# EAGLE design fabisp (EAGLE 7.5.0)
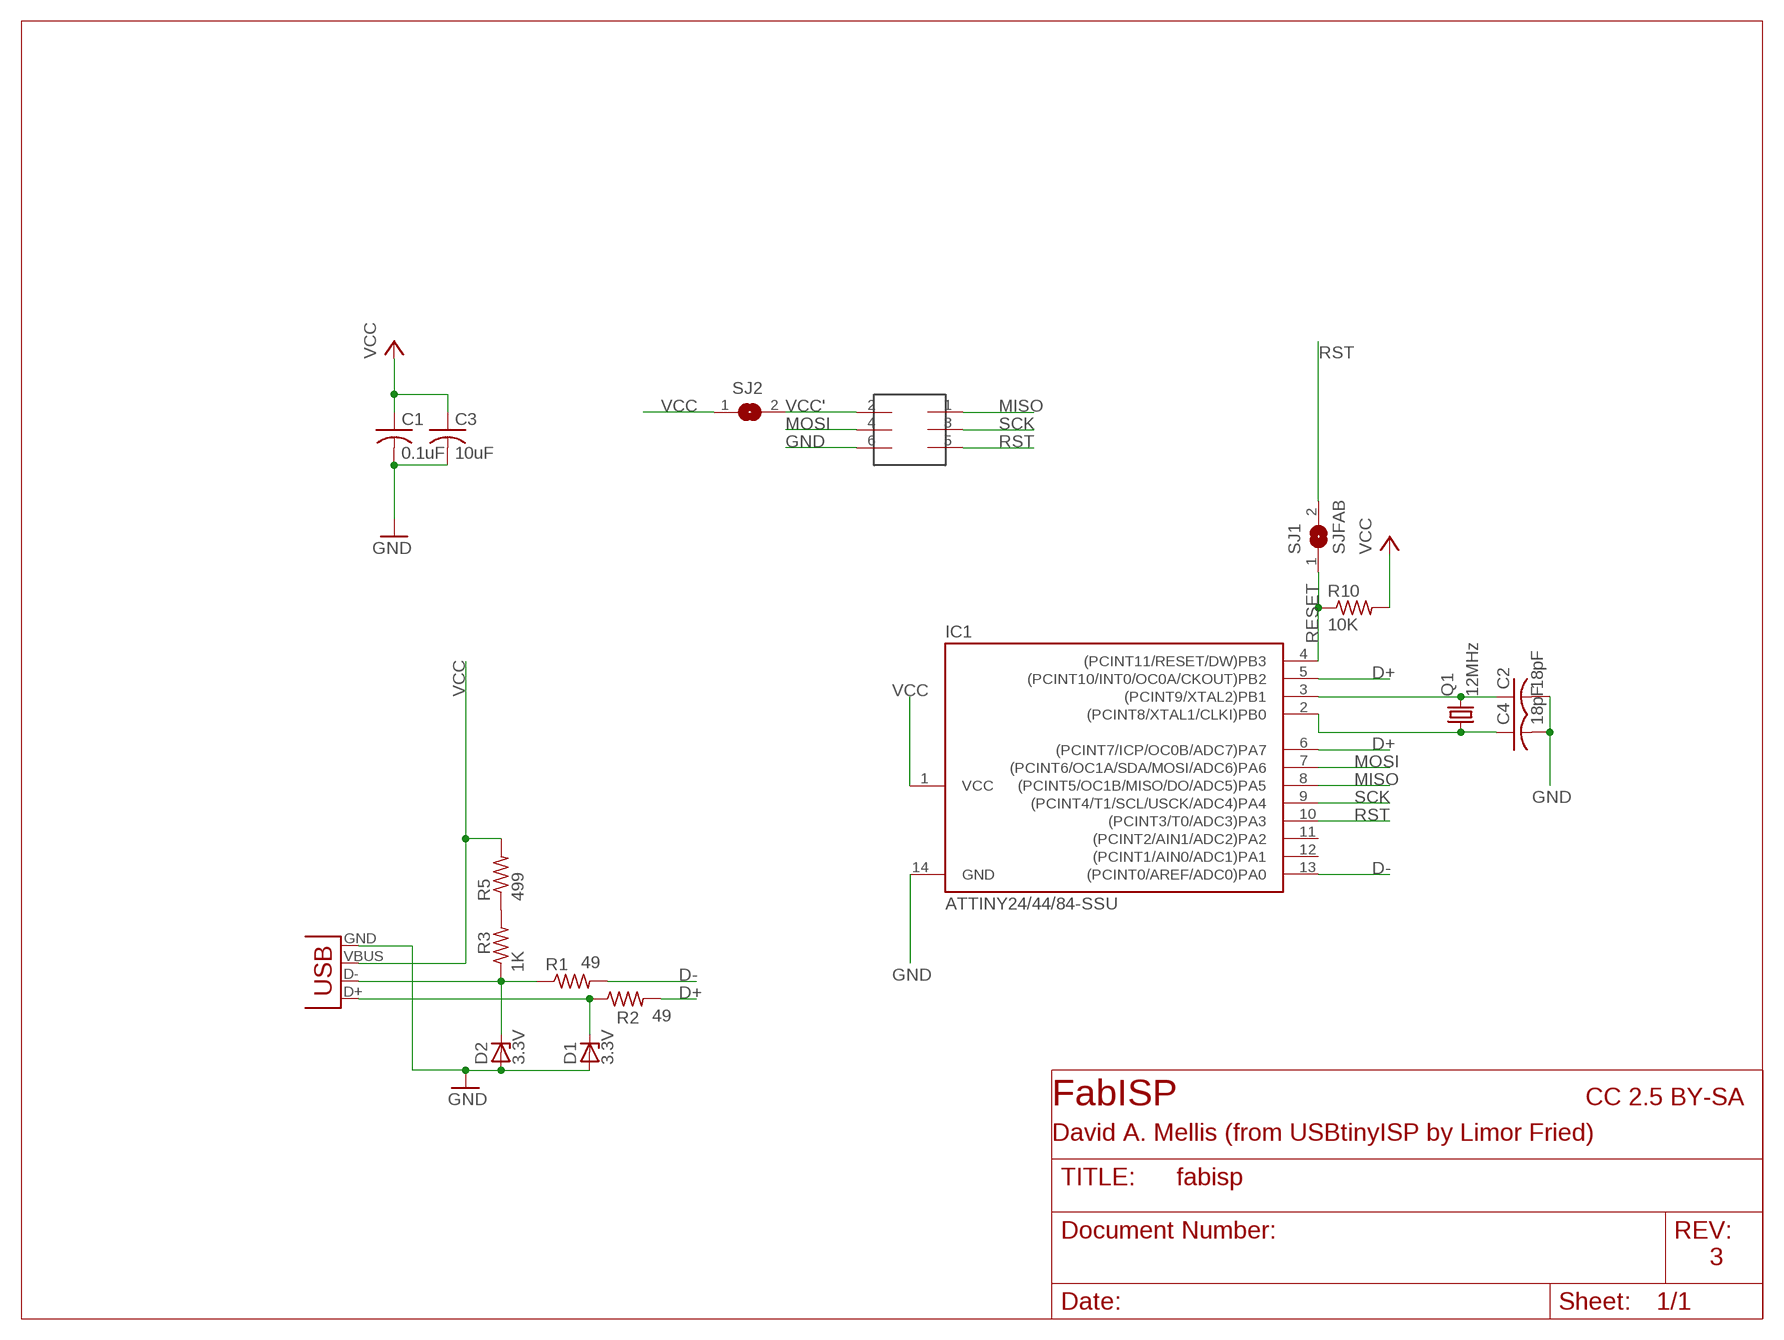
[diagram p0: schematic, sheet 1]

## Parts
C1  0.1uF  C-USC1206  [C1206]
C2  18pF  C-USC1206  [C1206]
C3  10uF  C-USC1206  [C1206]
C4  18pF  C-USC1206  [C1206]
D1  3.3V  ZENER_DIODESOD123  [SOD123]
D2  3.3V  ZENER_DIODESOD123  [SOD123]
IC1  ATTINY24/44/84-SSU  [SOIC14]
Q1  12MHz  CRYSTALHC49UP  [HC49UP]
R1  49  R-US_R1206  [R1206]
R2  49  R-US_R1206  [R1206]
R3  1K  R-US_R1206  [R1206]
R5  499  R-US_R1206  [R1206]
R10  10K  R-US_R1206  [R1206]
SJ1  SJFAB  [SJFAB]
SJ2  SJFAB  [SJFAB]
U$1  2X3HEADER  [2X3_SMD]
X1  USB_MINIB  [USB_MINIB]

## Nets
D+: IC1.5((PCINT10/INT0/OC0A/CKOUT)PB2) IC1.6((PCINT7/ICP/OC0B/ADC7)PA7) R2.2
D-: IC1.13((PCINT0/AREF/ADC0)PA0) R1.2
GND: C1.2 C2.2 C3.2 C4.2 D1.ANODE D2.ANODE IC1.14(GND) U$1.6 X1.GND
MISO: IC1.8((PCINT5/OC1B/MISO/DO/ADC5)PA5) U$1.1
MOSI: IC1.7((PCINT6/OC1A/SDA/MOSI/ADC6)PA6) U$1.4
N$1: D2.CATHODE R1.1 R3.1 X1.D-
N$2: D1.CATHODE R2.1 X1.D+
N$4: C4.1 IC1.2((PCINT8/XTAL1/CLKI)PB0) Q1.1
N$5: C2.1 IC1.3((PCINT9/XTAL2)PB1) Q1.2
N$6: R3.2 R5.1
RESET: IC1.4((PCINT11/RESET/DW)PB3) R10.1 SJ1.1
RST: IC1.10((PCINT3/T0/ADC3)PA3) SJ1.2 U$1.5
SCK: IC1.9((PCINT4/T1/SCL/USCK/ADC4)PA4) U$1.3
VCC: C1.1 C3.1 IC1.1(VCC) R5.2 R10.2 SJ2.1 X1.VBUS
VCC': SJ2.2 U$1.2
Unconnected: IC1.11((PCINT2/AIN1/ADC2)PA2) IC1.12((PCINT1/AIN0/ADC1)PA1)

## Notes on the sheet
- FabISP | CC 2.5 BY-SA
- David A. Mellis (from USBtinyISP by Limor Fried)
- 3

## Library data of the parts
C1 = rcl-ez:C-US: CAPACITOR, American symbol
C2-C4 = rcl:C-US: CAPACITOR, American symbol
D1 D2 = ng:ZENER_DIODE: zener diode
IC1 = attiny24_44_84:ATTINY24/44/84
Q1 = crystal:CRYSTAL: CRYSTAL
R1-R3 R10 = rcl-ez:R-US_: RESISTOR, American symbol
R5 = rcl:R-US_: RESISTOR, American symbol
SJ1 SJ2 = mellis:SJFAB
U$1 = mellis:2X3HEADER
X1 = mellis:USB_MINIB

## Board
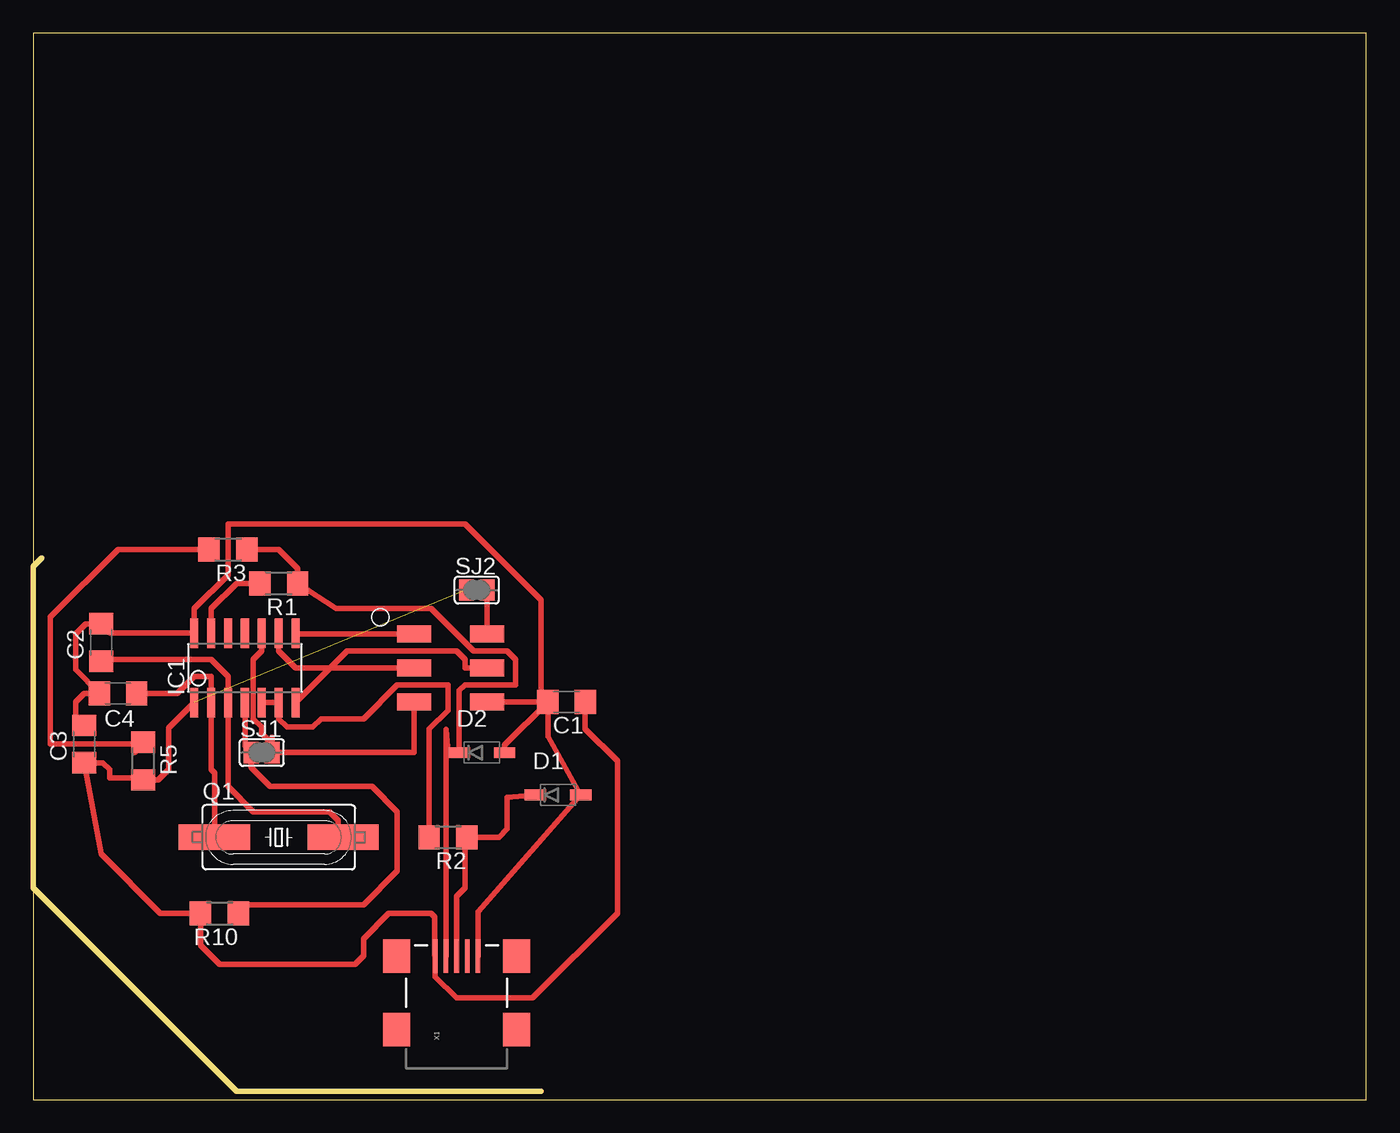
[diagram p1: board, top side]

Size 100 x 80 mm. Coordinates in mm from the lower left corner, seen from the top.
Outline: 0,0 100,0 100,80 0,80 0,0
Copper layers (1*16): Top 0.035mm / dielectric 1.5mm / Bottom 0.035mm
Design rules "default": minimum track width 10mil, minimum drill 24mil, track to track 8mil, track to pad 8mil, pad to pad 8mil, via to via 8mil, smd to smd 8mil, copper to edge 40mil, drill to drill 8mil, minimum pad ring 10mil, minimum via ring 8mil, stop-mask expansion 4mil, vias tented up to drill 0mil, thermal gap 10mil
Milling: 4 lines

### Footprints (pad centres in the part's own frame; a part is rotated, then mirrored left to right if it is on the bottom)
C1206 = smd 1.6 x 1.8: 1 -1.4,0; 2 1.4,0
SOD123 = smd 1.6 x 0.8: ANODE 1.7,0; CATHODE -1.7,0
SOIC14 = smd 0.61 x 2.21: 1 -3.81,-2.603; 2 -2.54,-2.603; 3 -1.27,-2.603; 4 0,-2.603; 5 1.27,-2.603; 6 2.54,-2.603; 7 3.81,-2.603; 8 3.81,2.603; 9 2.54,2.603; 10 1.27,2.603; 11 0,2.603; 12 -1.27,2.603; 13 -2.54,2.603; 14 -3.81,2.603
HC49UP = smd 5.334 x 1.93: 1 -4.826,0; 2 4.826,0
R1206 = smd 1.6 x 1.803: 1 -1.422,0; 2 1.422,0
SJFAB = smd 1.118 x 1.6: 1 -0.787,0; 2 0.787,0
2X3_SMD = smd 2.54 x 1.27: 1 -2.54,2.54; 2 2.92,2.54; 3 -2.54,0; 4 2.92,0; 5 -2.54,-2.54; 6 2.92,-2.54
USB_MINIB = smd 2.5 x 0.35: D+ 3.77,0; D- 3.77,0.8; GND 3.77,-1.6; ID 3.77,-0.8; VBUS 3.77,1.6 | smd 2.5 x 2: GND@1 -1.73,-4.5; GND@2 -1.73,4.5; GND@3 3.77,4.5; GND@4 3.77,-4.5

### Placement (x,y rotation side)
C1  40.01,29.84 180 top
C2  5.08,34.29 90 top
C3  3.81,26.67 90 top
C4  6.35,30.48 180 top
D1  39.37,22.86 0 top
D2  33.66,26.04 0 top
IC1  15.88,32.38 0 top
Q1  18.41,19.68 0 top
R1  18.41,38.73 180 top
R2  31.11,19.68 180 top
R3  14.61,41.27 180 top
R5  8.26,25.4 270 top
R10  13.97,13.97 180 top
SJ1  17.14,26.04 0 top
SJ2  33.27,38.23 0 top
U$1  31.11,32.38 0 top
X1  31.75,6.99 90 top

### Tracks (layer width: path | path; a pad name or v marks a point on that pad's centre or on a via)
D+
  Top 0.406: IC1.5 IC1.6 18.41,28.57 19.05,27.94 20.95,27.94 21.59,28.57 24.77,28.57 27.3,31.11 31.11,31.11 31.11,29.21 29.69,27.79 R2.2
D-
  Top 0.406: R1.2 15.24,38.73 13.34,36.83 IC1.13
GND
  Top 0.406: X1.GND 33.35,14.1 D1.ANODE 38.6,27.23 C1.2 | C3.2 3.17,28.7 3.17,29.84 3.81,30.48 C4.2 3.17,32.26 3.17,34.92 3.94,35.69 C2.2 5.78,34.99 IC1.14 12.06,36.83 14.61,39.37 14.61,43.18 32.38,43.18 38.1,37.47 38.1,30.35 C1.2 | U$1.6 34.92,29.84 | U$1.6 33.66,29.84 | C1.2 U$1.6 | D2.ANODE 35.35,26.59 C1.2
MISO
  Top 0.406: U$1.1 19.75,34.92 IC1.8
MOSI
  Top 0.406: U$1.4 32.38,32.38 32.38,33.02 31.75,33.66 23.56,33.66 IC1.7
N$1
  Top 0.406: X1.D- 30.95,27.77 31.11,26.04 D2.CATHODE 31.95,30.68 32.38,31.11 36.2,31.11 36.2,33.02 35.56,33.66 33.02,33.66 29.84,36.83 22.71,36.83 R1.1 19.84,39.85 18.41,41.27 R3.1
N$2
  Top 0.406: X1.D+ 31.75,15.24 32.38,15.88 32.38,19.68 R2.1 34.92,19.68 35.56,20.32 35.56,22.66 D1.CATHODE
N$4
  Top 0.406: C4.1 10.79,30.48 12.06,31.75 13.34,31.75 IC1.2 13.34,24.77 13.59,24.51 Q1.1
N$5
  Top 0.406: C2.1 5.21,33.02 13.34,33.02 14.61,31.75 IC1.3 14.61,23.5 16.51,21.59 22.23,21.59 22.86,20.95 22.86,20.07 Q1.2
N$6
  Top 0.406: R3.2 6.35,41.27 1.27,36.2 1.27,26.67 8.26,26.67 | 8.89,26.67 8.26,26.67 | 8.26,26.67 7.62,26.04 7.62,26.19 R5.1
RESET
  Top 0.406: IC1.4 15.88,26.52 SJ1.1 16.36,24.92 17.78,23.5 25.4,23.5 27.3,21.59 27.3,17.14 24.77,14.61 16.03,14.61 R10.1
RST
  Top 0.406: U$1.5 28.57,26.04 SJ1.2 17.93,26.67 | 17.93,26.67 17.93,27.15 | 17.14,35.56 IC1.10 17.14,33.66 16.51,33.02 16.51,28.57 17.14,27.94 17.14,27.46 17.93,26.67
SCK
  Top 0.406: U$1.3 19.68,32.38 18.41,33.66 IC1.9
VCC  (1 unrouted)
  Top 0.406: IC1.1 10.16,27.88 10.16,24.77 9.37,23.98 R5.2 8.1,24.13 5.71,24.13 5.71,24.77 5.21,25.27 C3.1 5.08,18.41 9.53,13.97 R10.2 12.55,11.58 13.97,10.16 24.13,10.16 24.77,10.79 24.77,12.06 26.67,13.97 29.84,13.97 30.1,13.72 30.1,10.81 X1.VBUS 30.15,9.22 31.75,7.62 37.47,7.62 43.81,13.97 43.81,25.4 41.41,27.81 C1.1
VCC'
  Top 0.406: U$1.2 34.03,38.48 34.29,38.73 34.29,38.46 SJ2.2